# EAGLE design main (EAGLE 5.11)
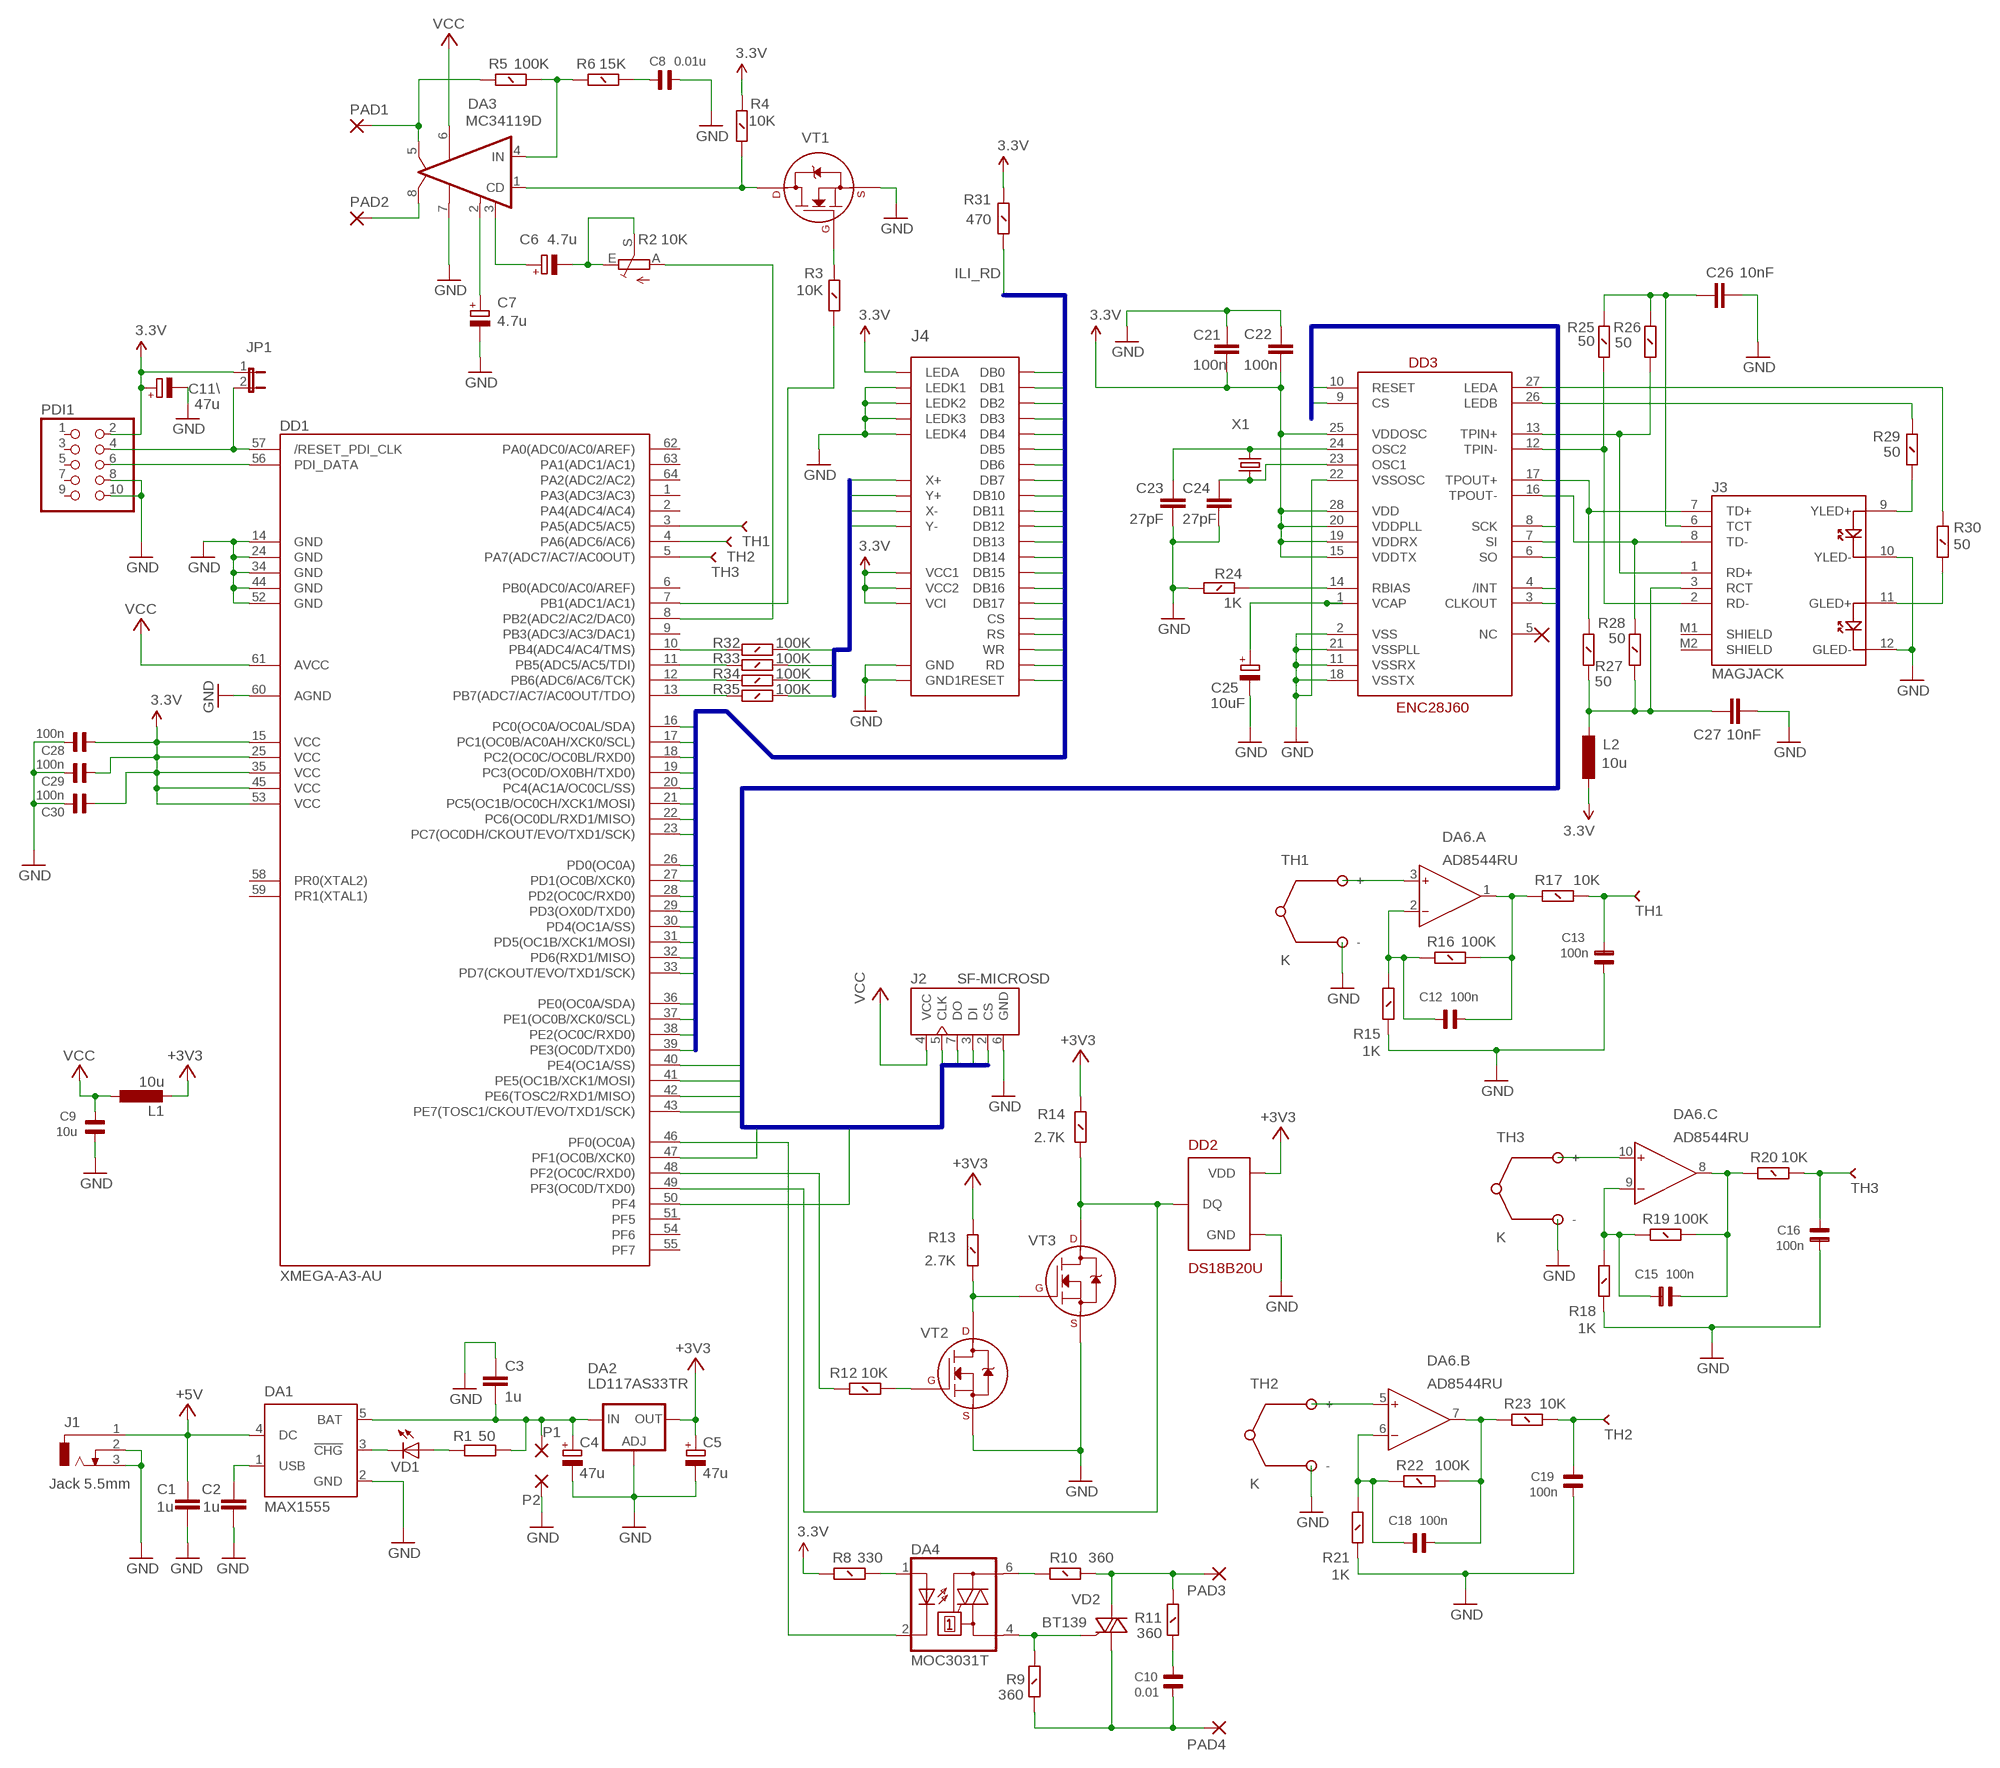
[diagram p0: schematic, sheet 1]

## Parts
C1  1u  C-EUC1206  [C1206]
C2  1u  C-EUC1206  [C1206]
C3  1u  C-EUC1206  [C1206]
C4  47u  CPOL-EUSMCD  [SMC_D]
C5  47u  CPOL-EUSMCD  [SMC_D]
C6  4.7u  CPOL-EUSMCD  [SMC_D]
C7  4.7u  CPOL-EUSMCD  [SMC_D]
C8  0.01u  C1206  [1206]
C9  10u  C1206  [1206]
C10  0.01  C1206  [1206]
C11\  47u  CPOL-EUSMCD  [SMC_D]
C12  100n  C1206  [1206]
C13  100n  C1206  [1206]
C15  100n  C1206  [1206]
C16  100n  C1206  [1206]
C18  100n  C1206  [1206]
C19  100n  C1206  [1206]
C21  100n  C-EUC1206  [C1206]
C22  100n  C-EUC1206  [C1206]
C23  27pF  C-EUC1206  [C1206]
C24  27pF  C-EUC1206  [C1206]
C25  10uF  CPOL-EUSMCD  [SMC_D]
C26  10nF  C-EUC1206  [C1206]
C27  10nF  C-EUC1206  [C1206]
C28  100n  C1206  [1206]
C29  100n  C1206  [1206]
C30  100n  C1206  [1206]
DA1  MAX1555  [SOT23-5L]
DA2  LD117AS33TR  [SOT223]
DA3  MC34119D  [SO08]
DA4  MOC3031T  [DIL06B]
DA6.  AD8544RU  [TSSOP14]
DD1  XMEGA-A3-AU  [TQFP64_14X14MM]
DD2  DS18B20U  [USOP]
DD3  ENC28J60  [SSOP28DB]
J1  Jack 5.5mm  DCJ0303  [DCJ0303]
J2  SF-MICROSD  [MICROSD]
J3  MAGJACK  [MAGJACK]
J4  DST2001PHREVB2.8  [REVB]
JP1  JUMPER-2PTH  [1X02]
L1  10u  L-EUL4532C  [L4532M]
L2  10u  L-EUL4532C  [L4532M]
P1  SMD5  [SMD2,54-5,08]
P2  SMD5  [SMD2,54-5,08]
PAD1  WIREPADSMD1,27-254  [SMD1,27-2,54]
PAD2  WIREPADSMD1,27-254  [SMD1,27-2,54]
PAD3  2,54/0,8  [2,54/0,8]
PAD4  2,54/0,8  [2,54/0,8]
PDI1  PINHD-2X5  [2X05]
R1  50  R-EU_R1206  [R1206]
R2  10K  TRIM_EU-ECP10P  [ECP10P]
R3  10K  RESISTOR  [R1206]
R4  10K  RESISTOR  [R1206]
R5  100K  RESISTOR  [R1206]
R6  15K  RESISTOR  [R1206]
R8  330  RESISTOR  [R1206]
R9  360  RESISTOR  [R1206]
R10  360  RESISTOR  [R1206]
R11  360  RESISTOR  [R1206]
R12  10K  RESISTOR  [R1206]
R13  2.7K  RESISTOR  [R1206]
R14  2.7K  RESISTOR  [R1206]
R15  1K  RESISTOR  [R1206]
R16  100K  RESISTOR  [R1206]
R17  10K  RESISTOR  [R1206]
R18  1K  RESISTOR  [R1206]
R19  100K  RESISTOR  [R1206]
R20  10K  RESISTOR  [R1206]
R21  1K  RESISTOR  [R1206]
R22  100K  RESISTOR  [R1206]
R23  10K  RESISTOR  [R1206]
R24  1K  RESISTOR  [R1206]
R25  50  RESISTOR  [R1206]
R26  50  RESISTOR  [R1206]
R27  50  RESISTOR  [R1206]
R28  50  RESISTOR  [R1206]
R29  50  RESISTOR  [R1206]
R30  50  RESISTOR  [R1206]
R31  470  RESISTOR  [R1206]
R32  100K  RESISTOR  [R1206]
R33  100K  RESISTOR  [R1206]
R34  100K  RESISTOR  [R1206]
R35  100K  RESISTOR  [R1206]
TH1  K  THERMOCOUPLE  [THERMOCOUPLE_CONNECTOR]
TH2  K  THERMOCOUPLE  [THERMOCOUPLE_CONNECTOR]
TH3  K  THERMOCOUPLE  [THERMOCOUPLE_CONNECTOR]
VD1  LED-FKIT-1206  [FKIT-LED-1206]
VD2  BT136  [TO220AB]
VT1  2N7002_SOT23  [SOT-23]
VT2  2N7002_SOT23  [SOT-23]
VT3  2N7002_SOT23  [SOT-23]
Y1  X1  CRYSTAL5X3  [CRYSTAL-SMD-5X3]

## Nets
3.3V [power]: C11\.+ C21.2 C22.2 C28.1 C29.1 C30.1 DD1.15(VCC1) DD1.25(VCC2) DD1.35(VCC3) DD1.45(VCC4) DD1.53(VCC5) DD3.15(VDDTX) DD3.19(VDDRX) DD3.20(VDDPLL) DD3.25(VDDOSC) DD3.28(VDD) J4.LEDA J4.VCC1 J4.VCC2 J4.VCI JP1.1 L2.2 PDI1.2 R4.1 R8.2 R31.1
+3V3: C5.+ DA2.4(OUT) DD2.VDD L1.2 R13.1 R14.1
+5V: C1.1 DA1.4(DC) J1.1
CLKOUT: DD3.3(CLKOUT)
CS: DD1.40(PE4(OC1A/SS)) J2.2(CS)
DA5: PAD3.1(P) R10.1 R11.1 VD2.2(A2)
DB0: DD1.16(PC0(OC0A/OC0AL/SDA)) J4.DB0
DB1: DD1.17(PC1(OC0B/AC0AH/XCK0/SCL)) J4.DB1
DB2: DD1.18(PC2(OC0C/OC0BL/RXD0)) J4.DB2
DB3: DD1.19(PC3(OC0D/OX0BH/TXD0)) J4.DB3
DB4: DD1.20(PC4(AC1A/OC0CL/SS)) J4.DB4
DB5: DD1.21(PC5(OC1B/OC0CH/XCK1/MOSI)) J4.DB5
DB6: DD1.22(PC6(OC0DL/RXD1/MISO)) J4.DB6
DB7: DD1.23(PC7(OC0DH/CKOUT/EVO/TXD1/SCK)) J4.DB7
DB10: DD1.26(PD0(OC0A)) J4.DB10
DB11: DD1.27(PD1(OC0B/XCK0)) J4.DB11
DB12: DD1.28(PD2(OC0C/RXD0)) J4.DB12
DB13: DD1.29(PD3(OX0D/TXD0)) J4.DB13
DB14: DD1.30(PD4(OC1A/SS)) J4.DB14
DB15: DD1.31(PD5(OC1B/XCK1/MOSI)) J4.DB15
DB16: DD1.32(PD6(RXD1/MISO)) J4.DB16
DB17: DD1.33(PD7(CKOUT/EVO/TXD1/SCK)) J4.DB17
DS18B20_RX: DD1.49(PF3(OC0D/TXD0)) DD2.DQ R14.2 VT3.3(D)
DS18B20_TX: DD1.48(PF2(OC0C/RXD0)) R12.1
ECNCS: DD1.47(PF1(OC0B/XCK0)) DD3.9(CS)
GND [power]: C1.2 C2.2 C3.1 C4.- C5.- C7.- C8.2 C9.1 C11\.- C13.2 C16.2 C19.2 C21.1 C22.1 C23.1 C24.2 C25.- C26.1 C27.2 C28.2 C29.2 C30.2 DA1.2(GND) DA2.1(ADJ) DA3.7(GND) DD1.14(GND1) DD1.24(GND2) DD1.34(GND3) DD1.44(GND4) DD1.52(GND5) DD1.60(AGND) DD2.GND DD3.2(VSS) DD3.11(VSSRX) DD3.18(VSSTX) DD3.21(VSSPLL) DD3.22(VSSOSC) J1.2 J1.3 J2.6(GND) J3.10(YLED-) J3.12(GLED-) J4.GND J4.GND1 J4.LEDK1 J4.LEDK2 J4.LEDK3 J4.LEDK4 P2.1(P) PDI1.8 PDI1.10 R15.2 R18.2 R21.2 R24.1 TH1.- TH2.- TH3.- VT1.2(S) VT2.2(S) VT3.2(S)
ILI_CS: DD1.36(PE0(OC0A/SDA)) J4.CS
ILI_RD: J4.RD R31.2
ILI_RS: DD1.37(PE1(OC0B/XCK0/SCL)) J4.RS
ILI_RST: DD1.39(PE3(OC0D/TXD0)) J4.RESET
ILI_WR: DD1.38(PE2(OC0C/RXD0)) J4.WR
INT: DD3.4(/INT)
IO: DD1.3(PA5(ADC5/AC5)) DD1.4(PA6(ADC6/AC6)) DD1.5(PA7(ADC7/AC7/AC0OUT)) ; supply symbol labelled TH3, TH2, TH1
N$1: C6.+ DA3.3(FC1)
N$2: C6.- R2.E R2.S
N$3: DA6..3(A:IN+) TH1.+
N$4: DA6..5(B:IN+) TH2.+
N$5: DA6..10(C:IN+) TH3.+
N$6: DD1.8(PB2(ADC2/AC2/DAC0)) R2.A
N$7: DA4.1(A) R8.1
N$8: DA1.3(!CHG) VD1.C
N$9: C2.1 DA1.1(USB)
N$10: R1.2 VD1.A
N$11: C3.2 C4.+ DA1.5(BAT) DA2.3(IN) P1.1(P) R1.1
N$12: C15.2 DA6..8(C:OUT) R19.1 R20.2
N$13: C15.1 DA6..9(C:IN-) R18.1 R19.2
N$14: DD1.10(PB4(ADC4/AC4/TMS)) R32.1
N$15: C18.2 DA6..7(B:OUT) R22.1 R23.2
N$16: C18.1 DA6..6(B:IN-) R21.1 R22.2
N$17: DD1.11(PB5(ADC5/AC5/TDI)) R33.1
N$18: R12.2 VT2.1(G)
N$19: R13.2 VT2.3(D) VT3.1(G)
N$20: C12.2 DA6..1(A:OUT) R16.1 R17.2
N$21: C12.1 DA6..2(A:IN-) R15.1 R16.2
N$22: DD1.56(PDI_DATA) PDI1.6
N$23: DD1.12(PB6(ADC6/AC6/TCK)) R34.1
N$24: J3.9(YLED+) R29.2
N$25: J3.11(GLED+) R30.2
N$26: DD1.13(PB7(ADC7/AC7/AC0OUT/TDO)) R35.1
N$28: DD3.26(LEDB) R29.1
N$29: DD3.27(LEDA) R30.1
N$32: DD3.12(TPIN-) J3.2(RD-) R25.2
N$33: DD3.13(TPIN+) J3.1(RD+) R26.2
N$34: C23.2 DD3.24(OSC2) Y1.3
N$35: C24.1 DD3.23(OSC1) Y1.1
N$36: C25.+ DD3.1(VCAP)
N$37: C26.2 J3.6(TCT) R25.1 R26.1
N$38: DA3.4(IN) R5.2 R6.1
N$41: C7.+ DA3.2(FC2)
N$42: C8.1 R6.2
N$43: DA3.1(CD) R4.2 VT1.3(D)
N$44: DA4.6(A2) R10.2
N$45: DA4.4(A1) R9.1 VD2.3(G)
N$46: DD3.14(RBIAS) R24.2
N$47: R3.1 VT1.1(G)
N$48: C10.1 R11.2
N$49: C10.2 PAD4.1(P) R9.2 VD2.1(A1)
N$50: DD1.7(PB1(ADC1/AC1)) R3.2
N$76: DD1.57(/RESET_PDI_CLK) JP1.2 PDI1.4
PHONE1: DA3.5(VO1) PAD1.1(P) R5.1
PHONE2: DA3.8(VO2) PAD2.1(P)
PWM_CTRL: DA4.2(C) DD1.46(PF0(OC0A))
RST: DD1.50(PF4) DD3.10(RESET)
SCK: DD1.43(PE7(TOSC1/CKOUT/EVO/TXD1/SCK)) DD3.8(SCK) J2.5(CLK)
SI: DD1.41(PE5(OC1B/XCK1/MOSI)) DD3.7(SI) J2.3(DI)
SO: DD1.42(PE6(TOSC2/RXD1/MISO)) DD3.6(SO) J2.7(DO)
TCT: C27.1 J3.3(RCT) L2.1 R27.2 R28.2
TD+: DD3.17(TPOUT+) J3.7(TD+) R27.1
TD-: DD3.16(TPOUT-) J3.8(TD-) R28.1
TH1: C13.1 R17.1
TH2: C19.1 R23.1
TH3: C16.1 R20.1
VCC: C9.2 DA3.6(VCC) DD1.61(AVCC) J2.4(VCC) L1.1
X+: J4.X+ R32.2
X-: J4.X- R34.2
Y+: J4.Y+ R33.2
Y-: J4.Y- R35.2
Unconnected: DA6..12(D:IN+) DA6..13(D:IN-) DA6..14(D:OUT) DD1.1(PA3(ADC3/AC3)) DD1.2(PA4(ADC4/AC4)) DD1.6(PB0(ADC0/AC0/AREF)) DD1.9(PB3(ADC3/AC3/DAC1)) DD1.51(PF5) DD1.54(PF6) DD1.55(PF7) DD1.58(PR0(XTAL2)) DD1.59(PR1(XTAL1)) DD1.62(PA0(ADC0/AC0/AREF)) DD1.63(PA1(ADC1/AC1)) DD1.64(PA2(ADC2/AC2)) DD3.5(NC) J3.M1(SHIELD) J3.M2(SHIELD) PDI1.1 PDI1.3 PDI1.5 PDI1.7 PDI1.9

## Buses
SI,SO,SCK,CS,CLKOUT,INT,RST,ECNCS
DB[0..7],DB[10..17],ILI_CS,ILI_RS,ILI_WR,ILI_RD,ILI_RST
X+,X-,Y+,Y-

## Notes on the sheet
- BT139

## Power pins joined to a net without a drawn wire
V+: DA6..4(P:V+)
V-: DA6..11(P:V-)

## Library data of the parts
C1-C3 C21-C24 C26 C27 = rcl:C-EU: CAPACITOR, European symbol
C4-C7 C11\ C25 = rcl:CPOL-EU: POLARIZED CAPACITOR, European symbol
C8-C10 C12 C13 C15 C16 C18 C19 C28-C30 = capsmd:C1206
DA1 = maxim:MAX1555: Dual-Input USB/AC Adapter 1-Cell Li+ Battery Chargers Source: http://www.maxim-ic.com .. MAX1551-MAX1555.pdf; MF: MAXIM; MPN: MAX1555EZK+T; OC_FARNELL: 1628222; OC_NEWARK: 59J2761
DA2 = v-reg:LD117A?*: Low drop fixed and adjustable positive voltage regulators 1 A Source: http://www.st.com/stonline/products/literature/ds/7194/ld1117axx.pdf
DA3 = linear:MC34119: Low Power Audio Amplifier Motorola
DA4 = optocoupler:MOC30*: 6-Pin DIP Zero-Cross Optoisolators Triac Driver Output (250/400 Volt Peak) Source: http://www.fairchildsemi.com/ds/MO/MOC3043-M.pdf; OC_FARNELL: unknown; OC_NEWARK: unknown
DA6. = analog-devices:AD8544: General-Purpose CMOS Rail-to-Rail Amplifiers Source: http://www.analog.com/static/imported-files/data_sheets/AD8541_8542_8544.pdf; MPN: AD8544ARUZ; OC_FARNELL: unknown; OC_NEWARK: 15P1001
DD1 = SparkFun:XMEGA-A3: Atmel's 8/16-bit AVR XMEGA A3 Microcontroller - ATxmega256A3, etc.
DD2 = DST2001PH_REVB:DS18B20: DS18B20 temperature sensor
DD3 = SparkFun:ENC28J60
J1 = con-jack:DCJ0303: DC POWER JACK Source: DCJ0303.pdf
J2 = microsd:SF-MICROSD
J3 = SparkFun:MAGJACK
J4 = DST2001PH_REVB:DST2001PH: DST2001PH ILI9320 based TFT Display
JP1 = SparkFun:JUMPER-2: Jumper Basic 0.1" spaced jumper. Use with breakaway headers.
L1 L2 = rcl:L-EU: INDUCTOR, European symbol
P1 P2 = wirepad:SMD5: SMD PAD
PAD1 PAD2 = wirepad:WIREPAD: Wire PAD connect wire on PCB
PAD3 PAD4 = wirepad:2,54/0,8: THROUGH-HOLE PAD
PDI1 = pinhead:PINHD-2X5: PIN HEADER
R1 = rcl:R-EU_: RESISTOR, European symbol
R2 = pot:TRIM_EU-: POTENTIOMETER
R3-R6 R8-R35 = DST2001PH_REVB:RESISTOR: SMD resistor, 0.25W
TH1-TH3 = DST2001PH_REVB:THERMOCOUPLE
VD1 = SparkFun:LED: LEDs Standard schematic elements and footprints for 5mm, 3mm, 1206, and 0603 sized LEDs. 5mm - Spark Fun Electronics SKU : COM-00529 (and others)
VD2 = triac:BT136: Triac BT136 series E sensitive gate Source: http://www.nxp.com/acrobat_download/datasheets/BT136_SERIES_E_2.pdf
VT1-VT3 = transistors:2N700*: 2N7000, 2N7002, NDS7002A N-channel enhancement mode MOSFET
Y1 = SparkFun:CRYSTAL: Crystals Various standard crystals. Proven footprints. Spark Fun Electronics SKU : COM-00534

## Board
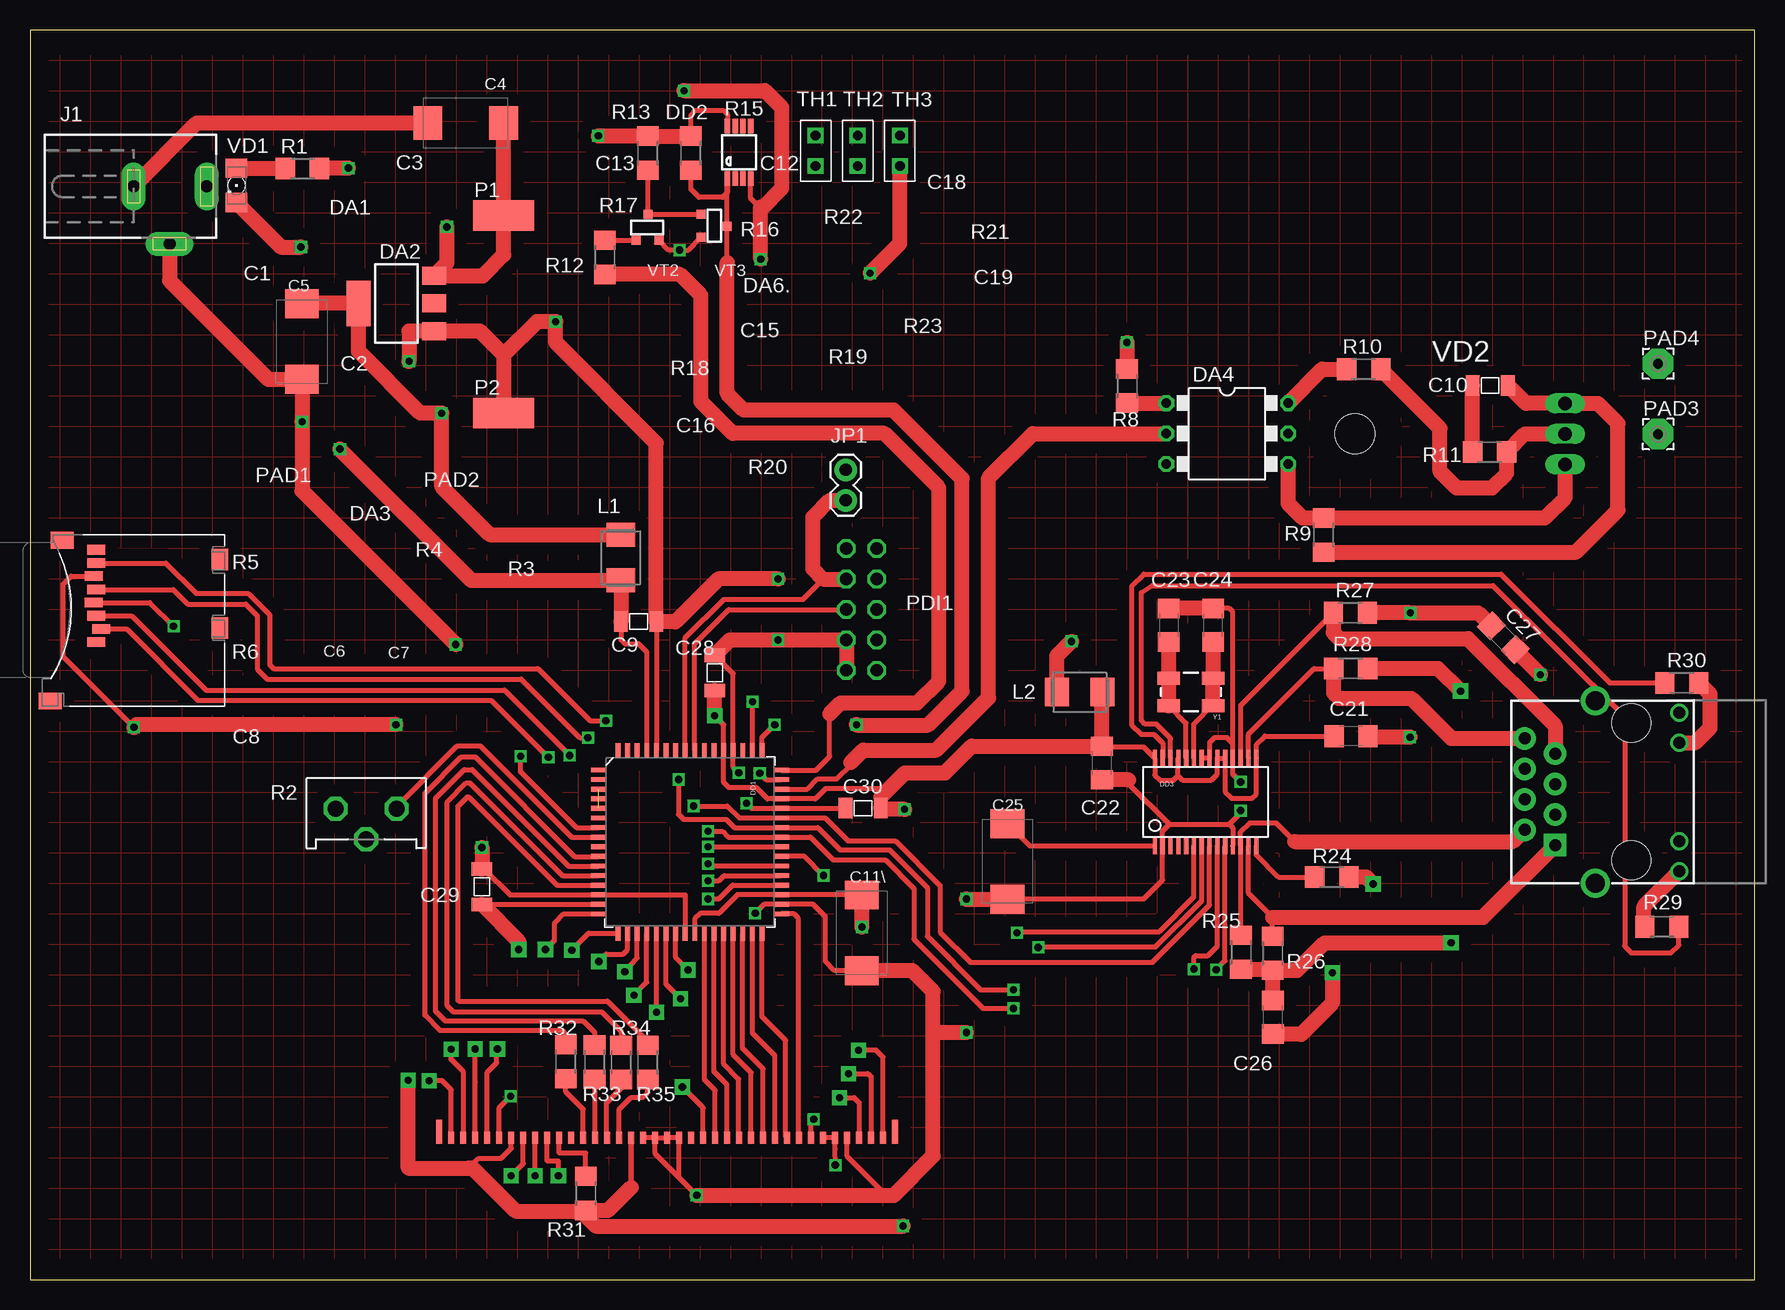
[diagram p1: board, top side]
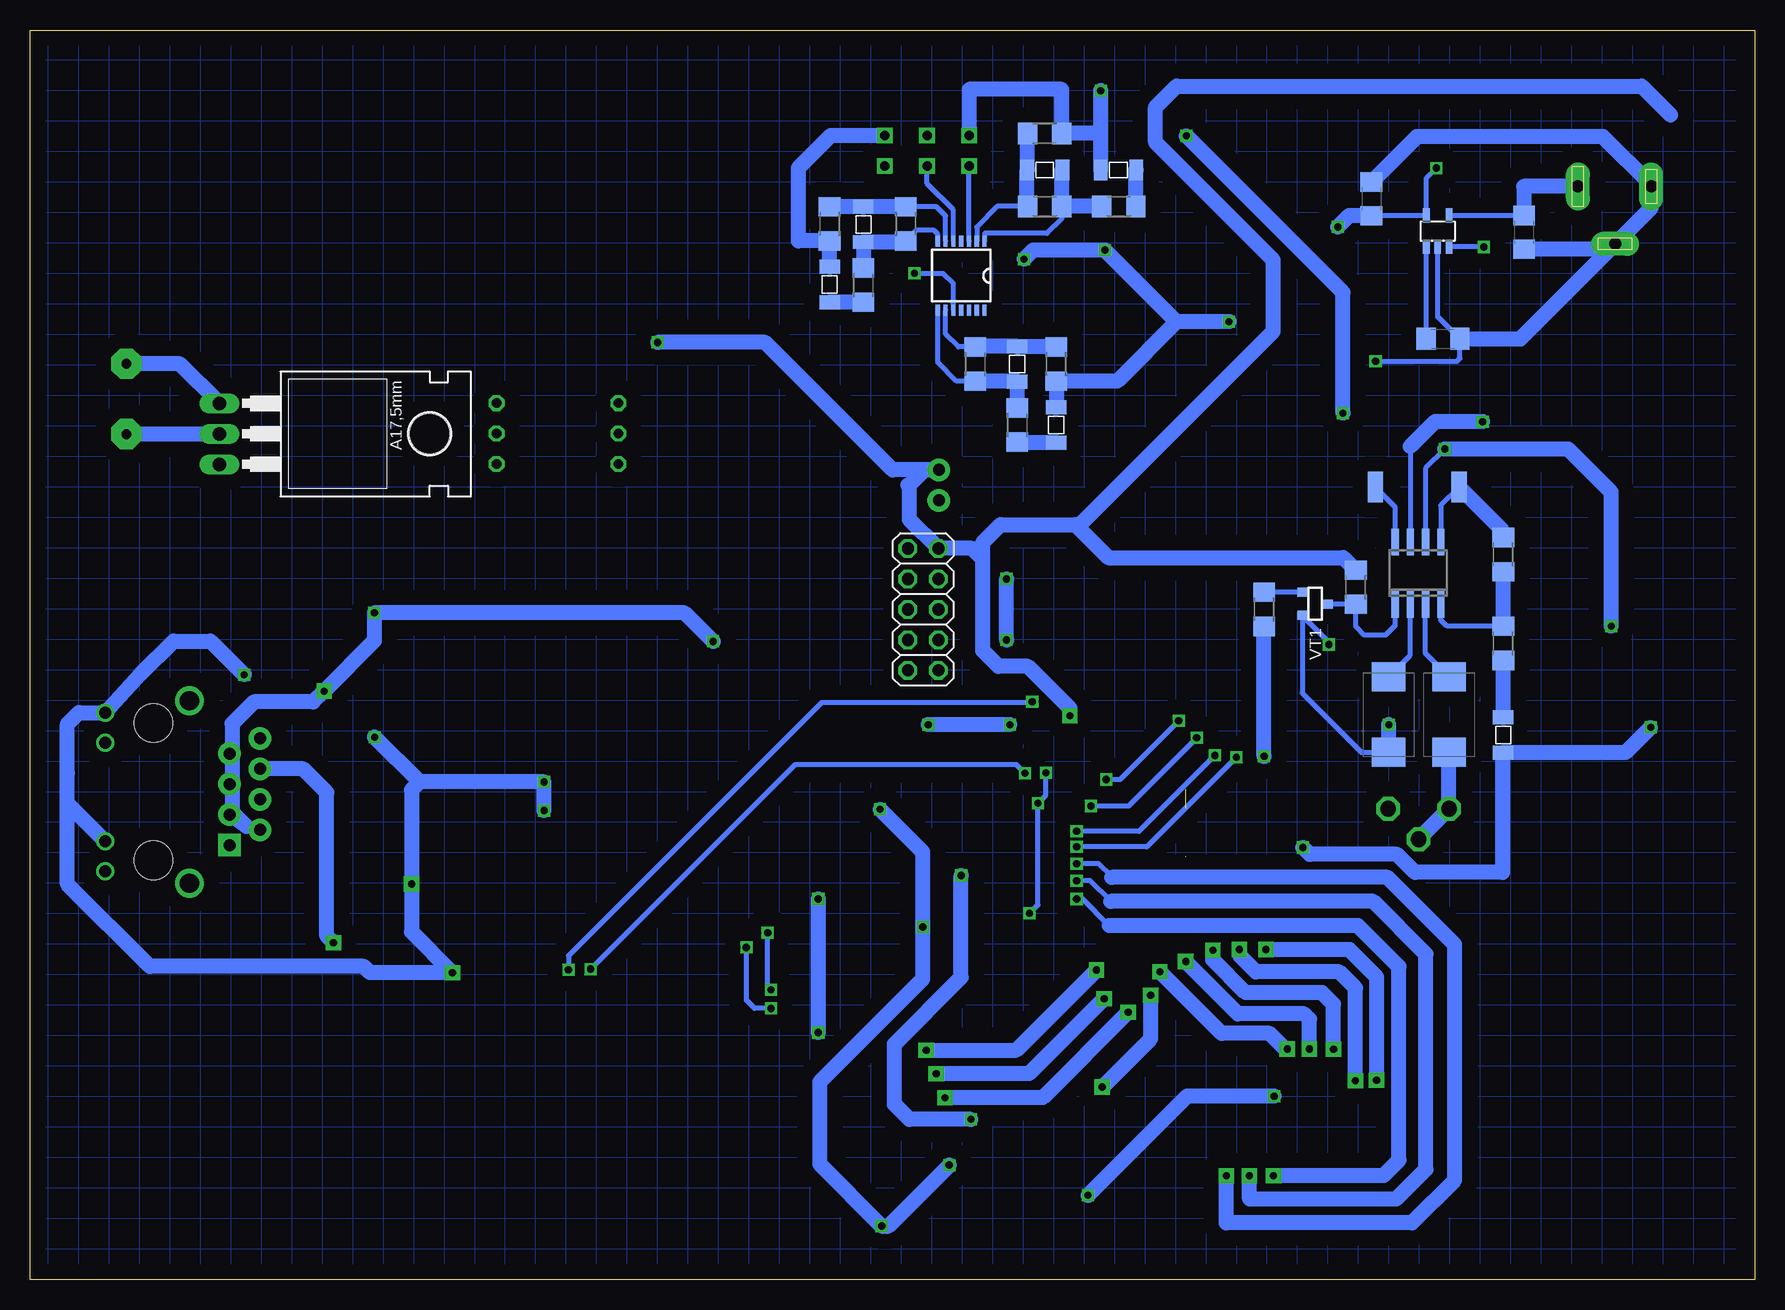
[diagram p2: board, bottom side, seen from below]

Size 143.76 x 104.14 mm. Coordinates in mm from the lower left corner, seen from the top.
Outline: 0,0 143.76,0 143.76,104.14 0,104.14 0,0
Copper layers (1*16): Top 0.035mm / dielectric 1.5mm / Bottom 0.035mm
Design rules "default": minimum track width 10mil, minimum drill 24mil, track to track 8mil, track to pad 8mil, pad to pad 8mil, via to via 8mil, smd to smd 8mil, copper to edge 40mil, drill to drill 8mil, minimum pad ring 10mil, minimum via ring 8mil, stop-mask expansion 4mil, vias tented up to drill 0mil, thermal gap 10mil

### Footprints (pad centres in the part's own frame; a part is rotated, then mirrored left to right if it is on the bottom)
C1206 = smd 1.6 x 1.8: 1 -1.4,0; 2 1.4,0
SMC_D = smd 2.4 x 2.8: + -3.15,0; - 3.15,0
1206 = smd 1.143 x 1.702: 1 -1.473,0; 2 1.473,0
SOT23-5L = smd 0.55 x 1.2: 1 -0.95,-1.3; 2 0,-1.3; 3 0.95,-1.3; 4 0.95,1.3; 5 -0.95,1.3
SOT223 = smd 1.5 x 2: 1 -2.3,-3.15; 2 0,-3.15; 3 2.3,-3.15 | smd 3.8 x 2: 4 0,3.15
SO08 = smd 0.6 x 2.2: 1 -1.905,-2.6; 2 -0.635,-2.6; 3 0.635,-2.6; 4 1.905,-2.6; 5 1.905,2.6; 6 0.635,2.6; 7 -0.635,2.6; 8 -1.905,2.6
DIL06B = drill 0.813 octagon: 1 -2.54,-5.08; 2 0,-5.08; 3 2.54,-5.08; 4 2.54,5.08; 5 0,5.08; 6 -2.54,5.08
TSSOP14 = smd 0.9 x 0.35: 1 -2.875,1.95; 2 -2.875,1.3; 3 -2.875,0.65; 4 -2.875,0; 5 -2.875,-0.65; 6 -2.875,-1.3; 7 -2.875,-1.95; 8 2.875,-1.95; 9 2.875,-1.3; 10 2.875,-0.65; 11 2.875,0; 12 2.875,0.65; 13 2.875,1.3; 14 2.875,1.95
TQFP64_14X14MM = smd 0.4 x 1.27: 1 -6,-7.6; 2 -5.2,-7.6; 3 -4.4,-7.6; 4 -3.6,-7.6; 5 -2.8,-7.6; 6 -2,-7.6; 7 -1.2,-7.6; 8 -0.4,-7.6; 9 0.4,-7.6; 10 1.2,-7.6; 11 2,-7.6; 12 2.8,-7.6; 13 3.6,-7.6; 14 4.4,-7.6; 15 5.2,-7.6; 16 6,-7.6; 33 6,7.6; 34 5.2,7.6; 35 4.4,7.6; 36 3.6,7.6; 37 2.8,7.6; 38 2,7.6; 39 1.2,7.6; 40 0.4,7.6; 41 -0.4,7.6; 42 -1.2,7.6; 43 -2,7.6; 44 -2.8,7.6; 45 -3.6,7.6; 46 -4.4,7.6; 47 -5.2,7.6; 48 -6,7.6 | smd 1.27 x 0.4: 17 7.6,-6; 18 7.6,-5.2; 19 7.6,-4.4; 20 7.6,-3.6; 21 7.6,-2.8; 22 7.6,-2; 23 7.6,-1.2; 24 7.6,-0.4; 25 7.6,0.4; 26 7.6,1.2; 27 7.6,2; 28 7.6,2.8; 29 7.6,3.6; 30 7.6,4.4; 31 7.6,5.2; 32 7.6,6; 49 -7.6,6; 50 -7.6,5.2; 51 -7.6,4.4; 52 -7.6,3.6; 53 -7.6,2.8; 54 -7.6,2; 55 -7.6,1.2; 56 -7.6,0.4; 57 -7.6,-0.4; 58 -7.6,-1.2; 59 -7.6,-2; 60 -7.6,-2.8; 61 -7.6,-3.6; 62 -7.6,-4.4; 63 -7.6,-5.2; 64 -7.6,-6
USOP = smd 0.45 x 1.2: 2 -0.325,-2.175; 3 0.325,-2.175; 6 -0.325,2.175; 7 0.325,2.175; 8 0.975,2.175; DQ -0.975,-2.175; GND 0.975,-2.175; VDD -0.975,2.175
SSOP28DB = smd 0.348 x 1.397: 1 -4.225,-3.656; 2 -3.575,-3.656; 3 -2.925,-3.656; 4 -2.275,-3.656; 5 -1.625,-3.656; 6 -0.975,-3.656; 7 -0.325,-3.656; 8 0.325,-3.656; 9 0.975,-3.656; 10 1.625,-3.656; 11 2.275,-3.656; 12 2.925,-3.656; 13 3.575,-3.656; 14 4.225,-3.656; 15 4.225,3.656; 16 3.575,3.656; 17 2.925,3.656; 18 2.275,3.656; 19 1.625,3.656; 20 0.975,3.656; 21 0.325,3.656; 22 -0.325,3.656; 23 -0.975,3.656; 24 -1.625,3.656; 25 -2.275,3.656; 26 -2.925,3.656; 27 -3.575,3.656; 28 -4.225,3.656
DCJ0303 = drill 1 pad 2 long: 1 0,3.1; 2 4.8,0; 3 0,-3
MICROSD = smd 0.8 x 1.5: 1 -1.94,2.7; 2 -0.84,2.3; 3 0.26,2.7; 4 1.36,2.9; 5 2.46,2.7; 6 3.56,2.9; 7 4.66,2.7; 8 5.76,2.7 | smd 1.4 x 1.9: NC -6.85,6.55; NC3 6.55,5.55 | smd 1.8 x 1.4: NC1 -0.75,-7.6; NC2 4.95,-7.6
MAGJACK = drill 1 pad 1.88 square: 1 3.175,17.445 | drill 1 pad 1.88 round: 2 4.445,19.985; 3 5.715,17.445; 4 6.985,19.985; 5 8.255,17.445; 6 9.525,19.985; 7 10.795,17.445; 8 12.065,19.985 | drill 1 pad 1.27 round: 9 1,7.1; 10 3.5,7.1; 11 11.7,7.1; 12 14.2,7.1 | drill 1.6 pad 2.184 round: M1 0,14.1; M2 15.2,14.1 | hole 3.2: 1.905,11.095; 13.335,11.095
REVB = smd 0.5 x 2: CONN_1 0.25,1; CONN_2 38.25,1 | smd 0.5 x 1: CS 7.25,0.5; DB0 1.25,0.5; DB1 2.25,0.5; DB2 3.25,0.5; DB3 4.25,0.5; DB4 22.25,0.5; DB5 35.25,0.5; DB6 36.25,0.5; DB7 37.25,0.5; DB10 23.25,0.5; DB11 24.25,0.5; DB12 25.25,0.5; DB13 26.25,0.5; DB14 27.25,0.5; DB15 28.25,0.5; DB16 29.25,0.5; DB17 30.25,0.5; GND 34.25,0.5; GND1 5.25,0.5; LDC-ID 21.25,0.5; LEDA 16.25,0.5; LEDK1 17.25,0.5; LEDK2 18.25,0.5; LEDK3 19.25,0.5; LEDK4 20.25,0.5; NC 11.25,0.5; RD 10.25,0.5; RESET 31.25,0.5; RS 8.25,0.5; VCC1 6.25,0.5; VCC2 33.25,0.5; VCI 32.25,0.5; WR 9.25,0.5; X+ 12.25,0.5; X- 14.25,0.5; Y+ 13.25,0.5; Y- 15.25,0.5
1X02 = drill 1.016 pad 1.88 round: 1 0,0; 2 2.54,0
L4532M = smd 2 x 2.4: 1 -1.9,0; 2 1.9,0
SMD2,54-5,08 = smd 2.54 x 5.08: 1 0,0
SMD1,27-2,54 = smd 1.27 x 2.54: 1 0,0
2,54/0,8 = drill 0.813 pad 2.54 octagon: 1 0,0
2X05 = drill 1.016 octagon: 1 -5.08,-1.27; 2 -5.08,1.27; 3 -2.54,-1.27; 4 -2.54,1.27; 5 0,-1.27; 6 0,1.27; 7 2.54,-1.27; 8 2.54,1.27; 9 5.08,-1.27; 10 5.08,1.27
R1206 = smd 1.6 x 1.803: 1 -1.422,0; 2 1.422,0
ECP10P = drill 1.321 octagon: A -2.54,0; E 2.54,0; S 0,2.54
THERMOCOUPLE_CONNECTOR = drill 0.8 square: + 0,1.27; - 0,-1.27
FKIT-LED-1206 = smd 1.6 x 1.803: A -1.422,0; C 1.422,0
TO220AB = drill 1.118 long: 1 -2.54,-6.35; 2 0,-6.35; 3 2.54,-6.35 | hole 3.302: 0,11.176
SOT-23 = smd 0.762 x 0.762: 1 -0.979,-1.101; 2 0.94,-1.101; 3 0.025,1.067
CRYSTAL-SMD-5X3 = smd 1.9 x 1.1: 1 -1.85,-1.15; 2 1.85,-1.15; 3 1.85,1.15; 4 -1.85,1.15

### Placement (x,y rotation side)
C1  19.23,87.27 270 bottom
C2  25.98,78.41 0 bottom
C3  31.95,90.07 270 bottom
C4  36.32,96.39 180 top
C5  22.68,78.18 270 top
C6  25.48,47.09 270 bottom
C7  30.51,47.09 270 bottom
C8  20.95,45.39 270 bottom
C9  50.72,54.84 180 top
C10  121.72,74.52 0 top
C11\  69.34,28.91 270 top
C12  59.18,92.48 0 bottom
C13  53.04,92.48 180 bottom
C15  61.47,76.3 270 bottom
C16  58.22,71.22 90 bottom
C18  74.3,87.93 270 bottom
C19  77.11,82.93 90 bottom
C21  110.11,45.29 180 top
C22  89.36,43.05 90 top
C23  94.92,54.53 270 top
C24  98.63,54.53 90 top
C25  81.48,34.85 270 top
C26  103.61,21.87 90 top
C27  122.81,53.49 315 top
C28  57.07,50.57 90 top
C29  37.67,32.74 90 top
C30  69.44,39.29 180 top
DA1  26.42,87.38 0 bottom
DA2  30.53,81.36 90 top
DA3  28.07,58.88 0 bottom
DA4  99.8,70.51 270 top
DA6.  66.14,83.67 270 bottom
DD1  55.02,36.47 270 top
DD2  59.11,93.95 0 top
DD3  97.99,39.8 0 top
J1  11.63,91.11 270 top
J2  8.23,55.07 90 top
J3  144.58,33.05 90 top
J4  33.86,11.33 0 top
JP1  68,67.49 270 top
L1  49.25,60.17 90 top
L2  87.5,48.97 0 top
P1  39.5,88.7 270 top
P2  39.5,72.24 270 top
PAD1  24.64,66.04 180 bottom
PAD2  31.62,66.04 0 bottom
PAD3  135.71,70.46 0 top
PAD4  135.71,76.33 0 top
PDI1  69.32,55.85 270 bottom
R1  22.71,92.61 180 top
R2  28.02,39.24 180 top
R3  40.89,55.85 270 bottom
R4  33.25,57.7 270 bottom
R5  20.95,60.43 270 bottom
R6  20.95,53.02 270 bottom
R8  91.44,74.47 90 top
R9  107.85,62.05 270 top
R10  111.18,75.87 180 top
R11  121.67,68.96 180 top
R12  47.9,85.19 90 top
R13  51.51,93.88 270 top
R14  55.09,93.88 270 top
R15  59.18,95.53 0 bottom
R16  59.18,89.43 180 bottom
R17  53.01,89.43 180 bottom
R18  58.22,76.3 270 bottom
R19  64.97,76.3 90 bottom
R20  61.47,71.22 90 bottom
R21  77.11,87.99 270 bottom
R22  70.76,87.99 90 bottom
R23  74.3,82.88 90 bottom
R24  108.51,33.55 180 top
R25  100.94,27.28 90 top
R26  103.58,27.2 90 top
R27  110.06,55.58 0 top
R28  110.08,50.93 0 top
R29  136.02,29.41 180 top
R30  137.69,49.73 0 top
R31  46.33,7.19 90 top
R32  44.65,18.16 270 top
R33  47.07,18.14 270 top
R34  49.28,18.11 270 top
R35  51.49,18.11 270 top
TH1  65.48,94.08 180 top
TH2  68.99,94.08 180 top
TH3  72.52,94.08 180 top
VD1  17.22,91.19 270 top
VD2  121.62,70.48 270 bottom
VT1  36.63,56.3 270 bottom
VT2  51.49,87.71 0 top
VT3  57.05,87.81 270 top
Y1  96.77,48.97 180 top

### Tracks (layer width: path | path; a pad name or v marks a point on that pad's centre or on a via)
3.3V  (via drill 0.6, 0.6 pad 1.27)
  Top 0.406: C21.2 102.92,45.29 102.23,44.6 102.23,43.48 DD3.15 102.21,43.45 102.21,40.46 101.85,40.11 100.18,40.11 99.62,40.67 DD3.19 DD3.20 98.97,42.12 98.48,41.63 96.06,41.63 95.71,41.99 | 95.71,41.99 95.71,43.45 DD3.25 | 95.71,41.99 95.33,41.6 94.21,41.6 93.77,42.05 DD3.28 92.83,44.4 89.41,44.4 C22.2 | v57.07,46.99 57.82,46.25 DD1.53 57.82,41.45 58.27,41 60.55,41 61.48,40.07 DD1.45 | DD1.15 43.29,31.27 43.28,31.27 C29.1 | J4.VCI J4.VCC2 67.11,10.9 v67.13,9.55 | J4.VCC1 40.11,10.95 39.27,10.11 37.41,10.11 36.6,9.3 | 50.11,7.69 J4.LEDA 50.11,7.73 | 45.82,5.71 45.87,5.77 | C11\.+ 69.32,32.07 DD1.35 58.98,32.08 57.43,30.53 55.88,30.53 55.42,30.07 DD1.25 | DD1.45 65.47,40.07 66.32,40.92 70.74,40.92 70.92,40.74 70.92,40.23 C30.1 | DD1.45 62.61,40.08
  Top 1.27: v57.07,46.99 C28.1 | v31.52,16.61 31.52,9.3 36.6,9.3 36.91,9.3 40.49,5.71 45.82,5.71 46.28,5.71 R31.1 48.18,5.77 50.11,7.69 | C29.1 40.74,28.19 v40.74,27.51 | L2.2 89.36,48.92 C22.2 78.49,44.45 76.28,42.24 72.92,42.24 70.92,40.23 | v91.44,78.11 R8.2 | C30.1 71.02,39.19 v72.9,39.19 | v69.34,29.39 C11\.+ | 45.87,5.77 47.17,4.47 v72.77,4.47
  Bottom 1.27: 70.46,66.24 69.22,67.49 JP1.1 71.86,67.49 82.47,78.11 v91.44,78.11 | 70.46,66.24 70.46,63.35 PDI1.2 65.23,60.94 64.34,60.05 | v40.74,27.51 33.78,27.51 31.5,25.22 31.5,16.64 v31.52,16.61 | 70.46,66.24 70.61,66.24 | R4.1 34.3,60.17 53.9,60.17 53.9,60.2 56.62,62.92 | 64.34,60.05 64.34,52.4 63.04,51.1 60.58,51.1 57.07,47.6 v57.07,46.99 | 64.34,60.05 64.34,61.44 62.87,62.92 56.62,62.92 | v72.9,39.19 69.34,35.64 v69.34,29.39 69.34,25.07 77.93,16.48 77.93,9.63 v72.77,4.47 | v72.77,4.47 72.62,4.47 | 56.62,62.92 56.24,62.92 40.13,79.02 40.13,84.96 49.94,94.77 49.94,97.71 48.18,99.47 9.42,99.47 7.01,97.05 | v67.13,9.55 72.21,4.47 v72.77,4.47
+3V3  (via drill 0.6)
  Top 0.406: R14.1 55.09,97.03 55.5,97.43 57.81,97.43 58.14,97.1 DD2.VDD
  Top 1.27: C5.+ 22.71,81.36 DA2.4 27.38,77.37 32.54,72.21 v34.31,72.21 34.31,66.09 38.33,62.08 L1.2 | R14.1 R13.1 51.48,95.33 v47.37,95.33
  Bottom 1.27: v34.31,72.21 34.31,82.27 v47.37,95.33
+5V
  Bottom 0.406: DA1.4 C1.1
  Bottom 1.27: J1.1 19.25,91.11 C1.1
CS  (via drill 0.6)
  Top 0.406: J2.2 8.05,54.23 13.99,48.28 38.46,48.28 v43.2,43.54 | v56.52,36.07 DD1.40
  Bottom 0.406: v56.52,36.07 50.67,36.07 v43.2,43.54
DA5
  Top 1.27: R11.1 124.61,70.48 VD2.2 | R11.1 123.09,67.21 121.87,65.99 118.9,65.99 117.53,67.36 117.53,70.94 R10.1 | R11.1
  Bottom 1.27: PAD3.1 127.99,70.46 VD2.2
DB0  (via drill 0.6 pad 1.27)
  Top 0.406: DD1.16 44.49,30.47 43.71,29.69 43.71,28.27 v42.95,27.51 | J4.DB0 35.11,15.82 34.34,16.59 v33.27,16.59
  Bottom 1.27: v42.95,27.51 42.95,27.03 41.58,25.65 34.62,25.65 33.27,24.31 v33.27,16.59
DB1  (via drill 0.6 pad 1.27)
  Top 0.406: J4.DB1 36.14,11.86 36.14,17.32 35.1,18.36 v35.1,19.2 | v45.16,27.46 46.58,28.87 DD1.17
  Bottom 1.27: v35.1,19.2 35.1,22.96 36.07,23.93 42.44,23.93 45.16,26.64 v45.16,27.46
DB2  (via drill 0.6 pad 1.27)
  Top 0.406: J4.DB2 37.11,16.48 v37.11,19.23 | DD1.18 49.81,28.87 49.81,27.51 49.43,27.13 48.03,27.13 v47.42,26.52
  Bottom 1.27: v37.11,19.23 37.11,21.72 37.54,22.15 43.08,22.15 47.42,26.49 v47.42,26.52
DB3  (via drill 0.6 pad 1.27)
  Top 0.406: DD1.19 50.62,26.79 v49.58,25.65 | J4.DB3 38.11,17.28 38.91,18.09 38.91,19.18 v38.96,19.23
  Bottom 1.27: v49.58,25.65 44.45,20.52 40.44,20.52 39.14,19.23 v38.96,19.23
DB4  (via drill 0.6 pad 1.27)
  Top 0.406: v54.38,16.05 56.11,14.33 J4.DB4 | v50.34,23.7 51.42,24.77 DD1.20
  Bottom 1.27: v50.34,23.7 50.34,20.09 v54.38,16.05
DB5  (via drill 0.6 pad 1.27)
  Top 0.406: J4.DB5 69.11,14.76 68.71,15.16 v67.49,15.16 | v52.22,22.28 DD1.21
  Bottom 1.27: v67.49,15.16 59.33,15.16 v52.22,22.28
DB6  (via drill 0.6 pad 1.27)
  Top 0.406: J4.DB6 70.11,16.91 69.85,17.17 v68.22,17.17 | v54.23,23.42 53.02,24.63 DD1.22
  Bottom 1.27: v68.22,17.17 60.48,17.17 v54.23,23.42
DB7  (via drill 0.6 pad 1.27)
  Top 0.406: J4.DB7 71.11,18.55 70.54,19.13 v69.06,19.13 | v54.86,25.81 53.82,26.85 DD1.23
  Bottom 1.27: v69.06,19.13 61.54,19.13 v54.86,25.81
DB10
  Top 0.406: DD1.26 56.22,16.68 57.12,15.77 57.12,11.85 J4.DB10
DB11
  Top 0.406: DD1.27 57.02,17.33 58.09,16.26 58.09,11.85 J4.DB11
DB12
  Top 0.406: DD1.28 57.82,17.98 59.08,16.71 59.08,11.86 J4.DB12
DB13
  Top 0.406: DD1.29 58.62,18.75 60.12,17.25 60.12,11.84 J4.DB13
DB14
  Top 0.406: DD1.30 59.42,19.27 61.11,17.58 J4.DB14
DB15
  Top 0.406: DD1.31 60.22,20.56 62.1,18.67 J4.DB15
DB16
  Top 0.406: DD1.32 61.02,21.91 62.99,19.94 62.99,11.95 J4.DB16
DB17
  Top 0.406: DD1.33 63.68,30.47 64.06,30.1 64.06,11.88 J4.DB17
DS18B20_RX  (via drill 0.6)
  Top 0.406: R14.2 55.09,90.86 55.75,90.19 57.73,90.19 58.14,90.6 DD2.DQ 58.12,91.76 VT3.3 58.12,84.78 | v62.08,46.25 61.02,45.19 DD1.49
  Top 1.27: 58.12,84.78 58.12,73.84 59.49,72.47 71.98,72.47 77.7,66.75 77.7,49.05 74.85,46.2 68.94,46.2 v68.89,46.25
  Bottom 1.27: v62.08,46.25 v68.89,46.25
DS18B20_TX
  Top 0.406: 66.65,47.14 66.65,43.59 65.53,42.47 DD1.48
  Top 1.27: 66.65,47.14 67.56,48.06 73.94,48.06 75.77,49.89 75.77,65.99 71.22,70.54 58.57,70.54 55.93,73.18 55.93,82.02 54.18,83.77 R12.1
ECNCS  (via drill 0.6)
  Top 0.406: DD3.9 98.97,27.77 98.2,27 97.16,27 97.03,26.87 v97.03,25.88 | DD1.47 61.37,41.67 v60.83,42.22
  Bottom 0.406: v97.03,25.88 79.98,42.93 61.54,42.93 v60.83,42.22
GND  (via drill 0.6, 0.6 pad 1.27)
  Top 0.406: 100.27,44.55 100.27,44.66 99.77,45.16 98.73,45.16 98.32,44.76 DD3.21 DD3.22 | 100.27,44.55 DD3.18 100.27,42.12 v100.91,41.48 | DD3.11 100.27,37.65 99.97,37.95 | 94.97,37.95 99.97,37.95 | 94.97,37.95 94.41,37.39 DD3.2 94.41,33.3 92.84,31.73 81.51,31.73 C25.- | C24.2 99.97,55.93 100.25,55.65 100.25,44.57 100.27,44.55 | 52.22,54.82 DD1.60 | J4.LEDK2 J4.LEDK3 J4.LEDK4 54.11,8.5 v55.58,7.04 52.11,10.5 J4.LEDK2 | J4.LEDK2 J4.LEDK1 | DD1.34 65.28,31.27 66.29,30.25 66.29,26.54 67.08,25.75 C11\.- | DD1.34 | C30.2 62.64,39.29 DD1.44 60.17,39.27 v59.74,39.7 | DD1.24 54.62,32.07 DD1.14 40.01,32.07 37.87,34.21 C29.2 | 91.57,41.65 91.57,41.35 94.97,37.95 | 99.97,37.95 100.91,38.89 v100.91,39.09 | VT2.2 53.23,85.8 v54.15,85.8 54.88,85.8 VT3.2 | J2.6 3.43,58.63 2.77,57.96 2.77,51.92 v8.66,46.02 | C28.2 58.62,50.5 DD1.52 58.62,42.7 v59.08,42.24 | J4.GND 68.11,10.3 71.37,7.04 | DD1.34 61.19,31.27 v60.45,30.53 | J4.GND1 39.11,14.34 v40.06,15.29 | DD2.GND 60.08,90.11 60.91,89.28
  Top 1.27: J1.2 11.63,83.26 19.86,75.03 C5.- v22.68,71.5 22.68,65.73 v35.48,52.93 | C4.- 13.92,96.39 J1.3 | 39.5,77.06 37.5,79.06 DA2.1 31.6,79.06 v31.6,76.53 | 39.5,77.06 P2.1 | C24.2 C23.1 | R24.1 111.38,33.55 v111.96,32.97 | v108.56,25.58 108.56,23.04 105.97,20.45 103.63,20.45 C26.1 | PDI1.10 PDI1.8 v62.36,53.31 58.34,53.31 C28.2 | C11\.- 73.56,25.75 75.29,24.03 75.29,20.5 | 75.29,20.5 75.29,10.31 72.01,7.04 71.37,7.04 v55.58,7.04 | v37.67,36.02 C29.2 | 91.57,41.65 C22.1 | C25.- 78.08,31.7 v78.05,31.73 | v78.05,20.6 75.39,20.6 75.29,20.5 | C27.2 125.88,50.42 v125.91,50.42 | C21.1 111.58,45.21 v115.04,45.21 | v30.5,46.25 8.89,46.25 v8.66,46.02 | 39.5,77.06 42.27,79.83 v43.81,79.83 43.81,78.11 52.2,69.72 C9.1 52.22,54.82 53.8,54.82 57.38,58.4 v62.36,58.4 | v54.51,99.08 61.27,99.08 62.66,97.69 62.66,90.96 61.01,89.31 | v60.91,85.04 60.91,89.28 60.91,89.41
  Bottom 0.406: DA1.2 26.42,80.24 C2.2 24.56,78.39 24.56,76.78 24.82,76.53 v31.6,76.53 | C7.- 32.79,43.94 37.72,48.87 VT1.2 35.48,53.12 v35.48,52.93 | 28.7,69.44 DA3.7 | v59.08,42.24 59.08,40.36 v59.74,39.7 59.74,31.24 v60.45,30.53
  Bottom 1.27: J1.2 19.53,78.41 C2.2 | C3.1 28.17,95.25 12.65,95.25 8.63,91.23 J1.3 8.63,89.31 J1.2 | C1.2 12.07,85.87 J1.2 | TH1.- 65.48,99.19 57.76,99.19 R15.2 54.51,95.53 C13.2 v54.51,99.08 | C19.2 R21.2 79.7,86.56 79.7,92.66 77.01,95.35 TH3.- | C16.2 R18.2 53.14,74.88 48.18,79.83 | v37.67,36.02 37.08,35.43 29.82,35.43 28.32,33.93 21.03,33.93 21.03,43.84 C8.2 10.77,43.92 v8.66,46.02 | v78.05,20.6 v78.05,31.73 | v125.91,50.42 128.7,53.21 131.8,53.21 134.53,50.48 J3.12 139.7,47.24 140.64,46.3 140.64,42.24 140.64,39.71 | 111.3,41.48 v100.91,41.48 v100.91,39.09 | 111.3,41.48 v115.04,45.21 | 111.3,41.48 111.96,40.82 v111.96,32.97 111.96,28.98 v108.56,25.58 115.42,25.58 115.95,26.11 133.78,26.11 140.64,32.97 140.64,39.71 | 48.18,79.83 v54.15,85.8 60.15,85.8 v60.91,85.04 | C7.- v30.5,46.25 | v22.68,71.5 26.64,71.5 28.7,69.44 | v43.81,79.83 48.18,79.83 | v62.36,53.31 v62.36,58.4 | v40.06,15.29 47.32,15.29 v55.58,7.04 | 140.64,39.71 J3.10
  pour Top (isolate 1.016, no thermals, hatched): 1.75,102.03 142.75,102.03 142.75,1.75 1.55,1.75 1.55,102.08
  pour Bottom (isolate 1.27, no thermals, hatched): 1.75,102.82 143.56,102.82 143.56,0.97 1.63,0.97 1.63,102.74
ILI_CS  (via drill 0.6, 0.6 pad 1.27)
  Top 0.406: J4.CS 41.11,9.66 v40.11,8.66 | v56.52,31.73 57.43,31.73 58.58,32.87 DD1.36
  Bottom 0.406: v56.52,31.73 56.03,31.73 53.82,29.52
  Bottom 1.27: v40.11,8.66 30.94,8.66 29.64,9.96 29.64,26.09 33.07,29.52 53.82,29.52
ILI_RD
  Top 0.406: J4.RD 44.11,10.54 46.33,10.54 R31.2
ILI_RS  (via drill 0.6, 0.6 pad 1.27)
  Top 0.406: J4.RS v42.11,8.66 | DD1.37 57.85,33.67 57.43,33.25 v56.52,33.25
  Bottom 0.406: v56.52,33.25 55.4,33.25 53.67,31.52
  Bottom 1.27: 53.67,31.52 31.8,31.52 27.41,27.13 27.41,9.2 29.9,6.71 42.11,6.71 v42.11,8.66
ILI_RST  (via drill 0.6)
  Top 0.406: J4.RESET 65.11,13.14 v65.33,13.36 | v66.14,33.68 64.55,35.27 DD1.39
  Bottom 1.27: v65.33,13.36 70.46,13.36 71.7,14.61 71.7,19.63 66.14,25.2 v66.14,33.68
ILI_WR  (via drill 0.6, 0.6 pad 1.27)
  Top 0.406: J4.WR 43.11,9.88 44.04,9.88 v44.04,8.66 | DD1.38 56.71,34.47 v56.52,34.67
  Bottom 0.406: v56.52,34.67 54.7,34.67 53.59,33.56 53.59,33.53
  Bottom 1.27: v44.04,8.66 44.04,4.72 28.57,4.72 24.99,8.31 24.99,27.91 30.61,33.53 53.59,33.53
IO  (2 unrouted)
N$1
  Bottom 0.406: DA3.3 27.43,52.2 C6.+
N$2
  Bottom 1.27: C6.- R2.E R2.S
N$3
  Bottom 0.406: DA6..3 65.49,92.8 TH1.+
N$4
  Bottom 0.406: DA6..5 66.79,89.14 68.99,91.34 TH2.+
N$5  (via drill 0.6)
  Top 1.27: v70.03,83.87 72.52,86.36 TH3.+
  Bottom 0.406: DA6..10 66.79,83 67.64,83.84 70,83.84 v70.03,83.87
N$6
  Top 0.406: DD1.8 47.41,36.88 45.14,36.88 37.54,44.48 35.61,44.48 30.56,39.42 R2.A
N$7
  Top 1.27: DA4.1 R8.1
N$8  (via drill 0.6)
  Top 1.27: VD1.C 20.93,86.06 v22.58,86.06
  Bottom 0.406: v22.58,86.06 22.6,86.08 DA1.3
N$9
  Bottom 0.406: C2.1 27.37,78.41 DA1.1
N$10
  Top 1.27: R1.2 VD1.A
N$11  (via drill 0.6)
  Top 1.27: P1.1 38.72,88.7 | C4.+ 39.47,88.72 P1.1 | R1.1 24.16,92.63 v26.54,92.63 | P1.1 39.5,85.39 37.76,83.66 DA2.3 34.75,84.72 v34.75,87.73
  Bottom 0.406: C3.2 27.37,88.67 DA1.5 27.37,91.81 v26.54,92.63
  Bottom 1.27: C3.2 33.81,88.67 v34.75,87.73
N$12
  Bottom 0.406: DA6..8 68.09,76.45 66.52,74.88 R19.1
  Bottom 1.27: R19.1 61.52,74.88 C15.2 R20.2
N$13
  Bottom 0.406: DA6..9 67.44,78.8 66.37,77.72 R19.2
  Bottom 1.27: R18.1 61.42,77.72 C15.1 64.92,77.78 R19.2
N$14  (1 unrouted)
  Top 0.406: R32.1 44.65,20.47 44.35,20.78 34.16,20.78 32.92,22.02 32.92,40.54 35.94,43.56 37.11,43.56 45.41,35.26 47.4,35.26
N$15
  Bottom 0.406: DA6..7 68.09,87.12 68.43,87.45 69.88,87.45 R22.1
  Bottom 1.27: R23.2 C18.2 70.76,86.46 R22.1
N$16
  Bottom 0.406: DA6..6 67.44,88.65 68.2,89.41 R22.2 | R22.2
  Bottom 1.27: R22.2 | R22.2 C18.1 | C18.1 | C18.1 R21.1
N$17
  Top 0.406: R33.1 47.07,20.6 46.1,21.57 34.62,21.57 33.81,22.38 33.81,40.11 36.2,42.49 36.85,42.49 44.88,34.47 DD1.11
N$18
  Top 0.406: R12.2 50.5,86.61 VT2.1
N$19
  Top 0.406: R13.2 VT2.3 55.93,88.77 VT3.1
N$20
  Bottom 0.406: DA6..1 64.19,87.2 58.98,87.2 57.76,88.42 R16.1
  Bottom 1.27: C12.2 57.76,92.43 R16.1 R17.2
N$21
  Bottom 0.406: DA6..2 64.84,87.74 63.14,89.43 R16.2
  Bottom 1.27: R16.2 60.66,89.48 C12.1 60.6,92.53 R15.1
N$22
  Top 0.406: PDI1.6 68.02,55.83 58.24,55.83 55.42,53 DD1.56
N$23
  Top 0.406: R34.1 49.28,20.7 47.65,22.33 35.28,22.33 34.77,22.84 34.77,39.8 36.37,41.4 36.65,41.4 44.38,33.67 DD1.12
N$24
  Top 1.27: R29.2 134.53,29.48 134.53,31.1 J3.9
N$25
  Top 1.27: R30.2 140.06,48.79 140.06,45.97 138.83,44.74 J3.11
N$26
  Top 0.406: R35.1 51.49,19.86 48.13,23.22 35.74,23.22 35.69,23.27 35.69,39.47 36.42,40.21 36.6,40.21 43.94,32.87 DD1.13
N$28
  Top 0.406: DD3.26 95.07,45.11 93.88,46.3 92.94,46.3 92.63,46.61 92.63,57.25 93.52,57.84 121.94,57.84 132.92,46.91 132.92,27.79 133.48,27.23 136.78,27.23 137.44,27.89 R29.1 | R29.1
N$29
  Top 0.406: DD3.27 94.42,44.7 93.67,45.44 92.61,45.44 91.87,46.18 91.87,57.84 92.84,58.8 122.61,58.8 131.67,49.73 R30.1
N$32
  Top 0.406: 105.44,36.5 103.86,38.08 101.68,38.08 100.91,37.31 DD3.12 100.92,28.72 R25.2
  Top 1.27: 105.44,36.5 123.6,36.5 J3.2
N$33
  Top 0.406: DD3.13 101.57,32.21 103.58,30.2 R26.2
  Top 1.27: 103.58,30.2 121.11,30.2 J3.1
N$34
  Top 0.406: Y1.3 96.37,46.38 DD3.24
  Top 1.27: C23.2 Y1.3
N$35
  Top 0.406: 98.62,47.9 97,46.28 97,43.47 DD3.23
  Top 1.27: C24.1 Y1.1 98.62,47.9
N$36
  Top 0.406: C25.+ 83.34,36.15 DD3.1
N$37  (via drill 0.6 pad 1.27)
  Top 1.27: R25.1 103.5,25.86 R26.1 | R26.1 103.58,23.3 C26.2 | v118.47,28.07 107.9,28.07 105.61,25.78 R26.1
  Bottom 1.27: v118.47,28.07 119.02,28.63 119.02,40.62 120.98,42.57 J3.6
N$38
  Bottom 0.406: DA3.4 26.16,54.97 25.65,54.46 20.97,54.46 R6.1
  Bottom 1.27: R6.1 R5.2
N$41
  Bottom 0.406: DA3.2 28.7,52.05 C7.+
N$42
  Bottom 1.27: C8.1 R6.2
N$43
  Bottom 0.406: DA3.1 29.97,54.53 30.79,53.72 32.54,53.72 33.25,54.43 R4.2 VT1.3 | VT1.3
N$44
  Top 1.27: DA4.6 107.7,75.87 R10.2
N$45
  Top 1.27: DA4.4 104.88,64.67 106.07,63.47 R9.1 126.26,63.47 127.97,65.18 VD2.3
N$46
  Top 0.406: DD3.14 102.22,35.4 104.06,33.55 R24.2
N$47
  Bottom 0.406: R3.1 VT1.1
N$48
  Top 1.27: R11.2 C10.1 | R11.2
N$49
  Top 1.27: C10.2 124.69,73.03 VD2.1 127.99,73 130.71,73 132.36,71.35 132.36,64.14 128.85,60.63 R9.2
  Bottom 1.27: PAD4.1 131.27,76.33 VD2.1
N$50  (via drill 0.6)
  Top 0.406: DD1.7 45.56,37.67 40.89,42.32 v40.89,43.61
  Bottom 1.27: v40.89,43.61 R3.2
N$76
  Top 0.406: 66.12,58.37 64.44,56.69 57.84,56.69 54.62,53.47 DD1.57
  Top 1.27: JP1.2 66.65,64.95 65.25,63.55 65.25,59.23 66.12,58.37 68.02,58.37 PDI1.4
PHONE1
  Bottom 0.406: PAD1.1 26.16,64.52 DA3.5
  Bottom 1.27: R5.1 | R5.1 20.95,62.36 PAD1.1
PHONE2
  Bottom 0.406: PAD2.1 29.97,64.39 DA3.8
PWM_CTRL
  Top 0.406: DD1.46 64.8,40.87 65.66,41.73 67.23,41.73 68.43,42.93 68.43,43.1
  Top 1.27: DA4.2 83.59,70.51 79.91,66.83 79.91,48.49 75.54,44.12 69.44,44.12 68.43,43.1
RST  (via drill 0.6)
  Top 0.406: v60.22,48.16 60.22,44.08 DD1.50 | DD3.10 99.62,26.57 v98.88,25.83
  Bottom 0.406: v60.22,48.16 60.3,48.08 77.8,48.08 98.88,27 v98.88,25.83
SCK  (via drill 0.6)
  Top 0.406: DD3.8 98.32,31.21 93.55,26.44 78.38,26.44 75.87,28.96 75.87,32.84 72.14,36.58 68.17,36.58 66.28,38.47 DD1.43 62.61,38.48 59.13,38.48 58.14,39.47 v55.32,39.47 | J2.5 5.55,57.51 11.94,57.51 13.16,56.29 17.98,56.29 18.95,55.32 18.95,50.88 19.79,50.04 40.95,50.04 45.82,45.16 v46.51,45.16
  Bottom 0.406: v46.51,45.16 52.2,39.47 v55.32,39.47
SI  (via drill 0.6)
  Top 0.406: DD3.7 97.67,31.58 93.83,27.74 84.1,27.74 v84.05,27.69 | v81.99,22.61 79.45,22.61 73.69,28.37 73.69,32.59 71.3,34.98 66.95,34.98 65.06,36.87 DD1.41 58.2,36.87 57.71,37.36 v56.52,37.36 | J2.3 8.48,55.33 14.68,49.12 39.55,49.12 v44.98,43.69
  Bottom 0.406: v84.05,27.69 84.05,23.27 83.39,22.61 v81.99,22.61 | v56.52,37.36 51.31,37.36 v44.98,43.69
SO  (via drill 0.6)
  Top 0.406: DD3.6 97.02,31.89 94.13,29.01 82.37,29.01 v82.27,28.91 | v81.99,24.16 79.25,24.16 74.8,28.6 74.8,32.66 71.65,35.81 67.54,35.81 65.68,37.67 DD1.42 58.73,37.67 58.04,38.35 54.48,38.35 54.05,38.79 v54.05,41.68 | v48.01,46.58 46.69,46.58 42.34,50.93 20.3,50.93 19.99,51.23 19.99,55.4 18.19,57.2 13.84,57.2 11.33,59.72 5.54,59.72 J2.7
  Bottom 0.406: v82.27,28.91 82.27,24.43 v81.99,24.16 | v48.01,46.58 52.91,41.68 v54.05,41.68
TCT  (via drill 0.6, 0.6 pad 1.27)
  Top 1.27: R27.2 v115.06,55.58 120.73,55.58 C27.1 | L2.1 85.6,51.97 v86.82,53.19 | R28.2 117.37,50.93 v119.25,49.05
  Bottom 1.27: J3.3 125.73,37.77 126.92,38.96 126.92,46.33 125.09,48.16 120.14,48.16 v119.25,49.05 115.06,53.24 v115.06,55.58 89.2,55.58 v86.82,53.19
TD+
  Top 0.406: DD3.17 100.92,47.86 R27.1
  Top 1.27: R27.1 108.64,53.92 109.14,53.42 119.86,53.42 127.13,46.15 J3.7
TD-
  Top 0.406: DD3.16 101.57,45.46 107.04,50.93 R28.1
  Top 1.27: R28.1 108.66,48.87 109.09,48.44 115.14,48.44 118.47,45.11 J3.8
TH1
  Bottom 1.27: C13.1 51.59,92.46 R17.1
TH2
  Bottom 1.27: C19.1 | R23.1 C19.1
TH3
  Bottom 1.27: C16.1 61.42,69.75 R20.1
VCC  (via drill 0.6)
  Top 0.406: DD1.61 51.42,52.32 50.72,53.01 49.55,53.01 49.25,53.31 C9.2 | J2.4 9.99,56.43 v11.96,54.46
  Top 1.27: C9.2 L1.1 36.77,58.27 v25.83,69.22
  Bottom 0.406: DA3.6 27.43,67.61 v25.83,69.22
  Bottom 1.27: v11.96,54.46 11.96,65.63 15.54,69.22 v25.83,69.22
X+
  Top 0.406: J4.X+ 46.11,14.22 44.65,15.67 R32.2
X-
  Top 0.406: J4.X- 48.08,11.85 48.08,14.76 49.28,15.95 R34.2
Y+
  Top 0.406: J4.Y+ 47.11,16.67 R33.2
Y-
  Top 0.406: J4.Y- 49.11,14.18 50.11,15.19 51.08,15.19 51.49,15.6 R35.2